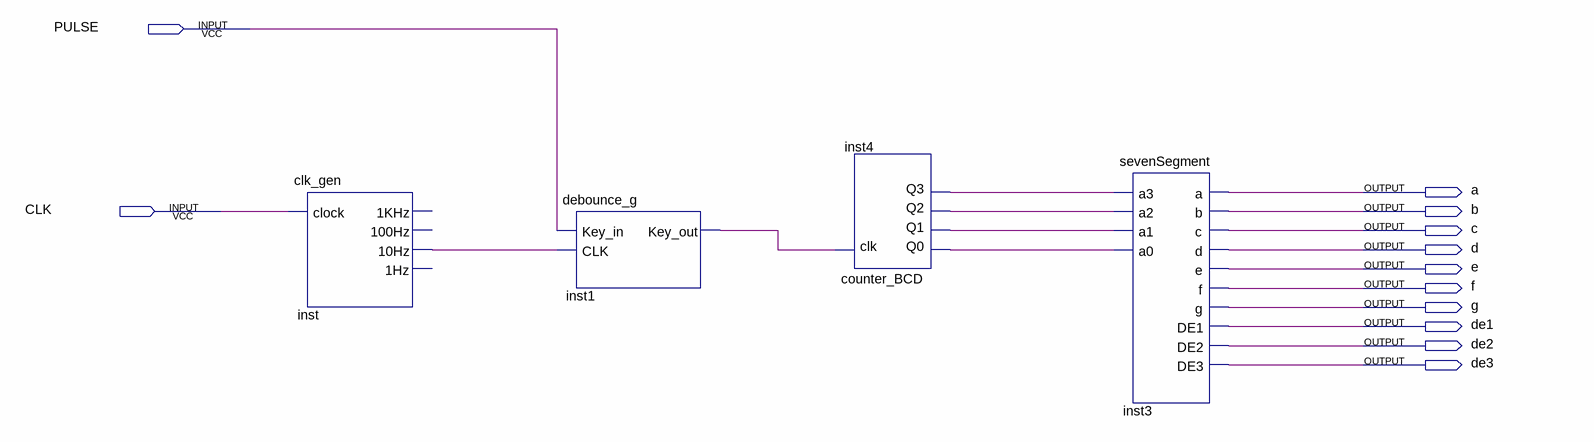
[diagram p0: schematic sheet]
// Quartus schematic bcdcounter_debounce.bdf as structural Verilog: 4 symbols, 12 pins
module bcdcounter_debounce (
  input  PULSE,
  input  CLK,
  output a,
  output b,
  output c,
  output d,
  output e,
  output f,
  output g,
  output de1,
  output de2,
  output de3
);

  wire inst1_key_out, inst4_q0, inst4_q1, inst4_q2, inst4_q3, inst_10hz;

  clk_gen inst (.clock(CLK), .\10Hz (inst_10hz));  // open: 1KHz, 100Hz, 1Hz
  debounce_g inst1 (.Key_in(PULSE), .CLK(inst_10hz), .Key_out(inst1_key_out));
  counter_BCD inst4 (.clk(inst1_key_out), .Q0(inst4_q0), .Q1(inst4_q1), .Q2(inst4_q2), .Q3(inst4_q3));
  sevenSegment inst3 (
    .a3(inst4_q3), .a2(inst4_q2), .a1(inst4_q1), .a0(inst4_q0), .a(a), .b(b), .c(c), .d(d), .e(e), .f(f),
    .g(g), .DE1(de1), .DE2(de2), .DE3(de3));
endmodule
